# EAGLE design compute hub (EAGLE 9.3.0)
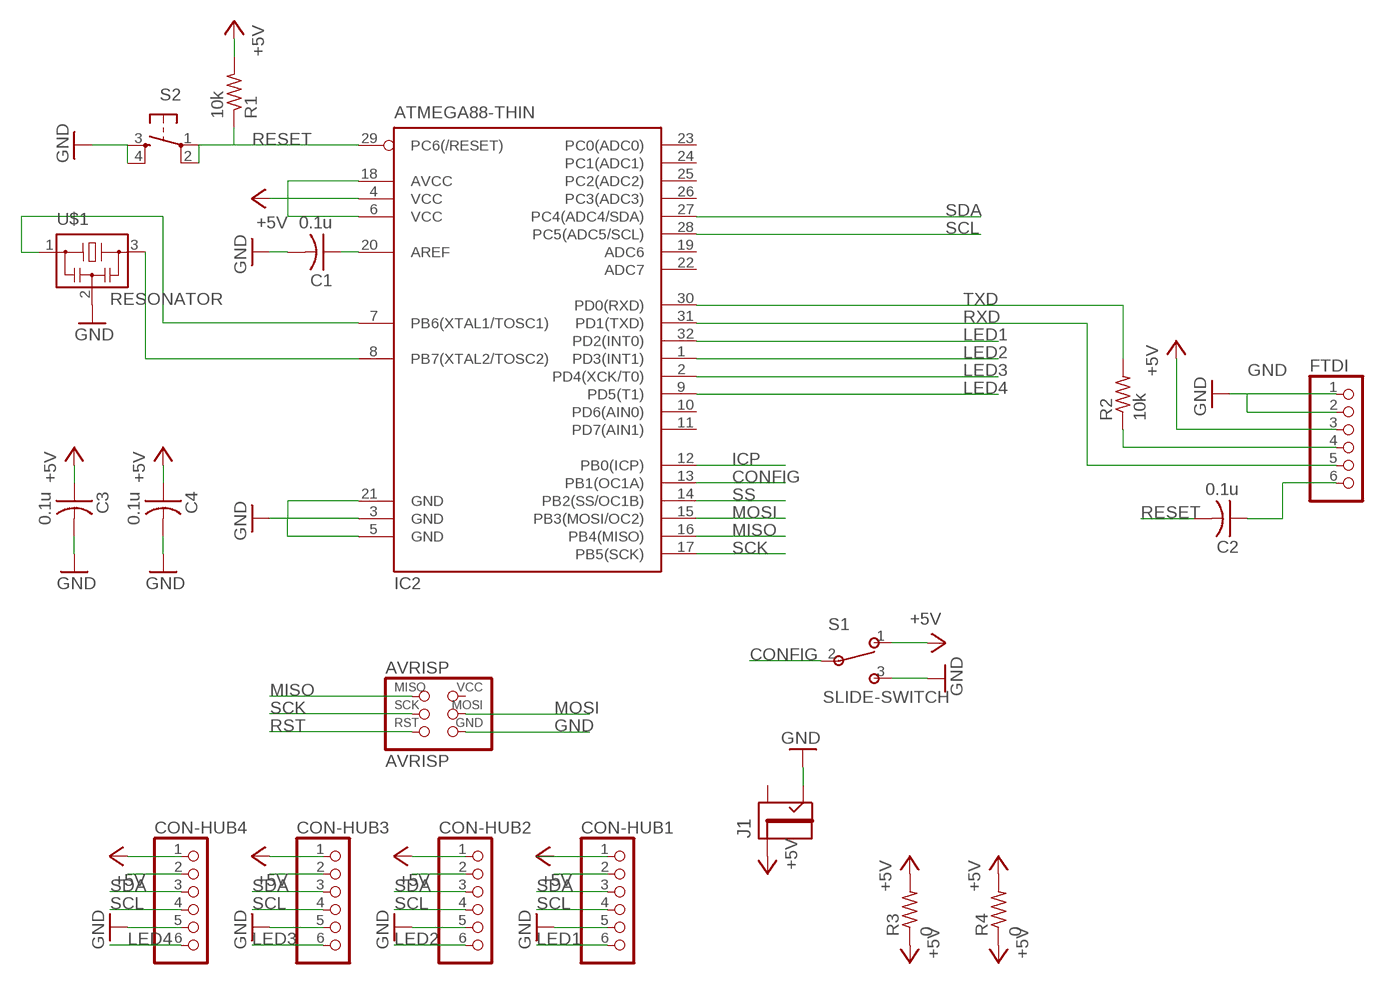
[diagram p0: schematic, sheet 1]

## Parts
AVRISP  AVRISP  [2X03]
C1  0.1u  CAP-US1206FAB  [C1206FAB]
C2  0.1u  CAP-US1206FAB  [C1206FAB]
C3  0.1u  CAP-US1206FAB  [C1206FAB]
C4  0.1u  CAP-US1206FAB  [C1206FAB]
CON-HUB1  PINHD-1X6  [1X06]
CON-HUB2  PINHD-1X6  [1X06]
CON-HUB3  PINHD-1X6  [1X06]
CON-HUB4  PINHD-1X6  [1X06]
FTDI  PINHD-1X6  [1X06]
IC2  ATMEGA88-THIN  [TQFP32-08THIN]
J1  JACK2.1MM  [JACK_2.1MM]
R1  10k  RES-US1206FAB  [R1206FAB]
R2  10k  RES-US1206FAB  [R1206FAB]
R3  0  RES-US1206FAB  [R1206FAB]
R4  0  RES-US1206FAB  [R1206FAB]
S1  SLIDE-SWITCH  [AYZ0102AGRLC]
S2  6MM_SWITCH6MM_SWITCH  [6MM_SWITCH]
U$1  RESONATOR  [EFOBM]

## Nets
+5V: C3.1 C4.1 CON-HUB1.1 CON-HUB2.1 CON-HUB3.1 CON-HUB4.1 FTDI.3 IC2.4(VCC) IC2.6(VCC) IC2.18(AVCC) J1.PIN R1.2 R3.1 R3.2 R4.1 R4.2
CONFIG: IC2.13(PB1(OC1A)) S1.2
GND: AVRISP.6(GND) C1.2 C3.2 C4.2 CON-HUB1.5 CON-HUB2.5 CON-HUB3.5 CON-HUB4.5 FTDI.1 FTDI.2 IC2.3(GND) IC2.5(GND) IC2.21(GND) J1.CONTACT S1.3 S2.3(S) S2.4(S1) U$1.2
ICP: IC2.12(PB0(ICP))
LED1: CON-HUB1.6 IC2.32(PD2(INT0))
LED2: CON-HUB2.6 IC2.1(PD3(INT1))
LED3: CON-HUB3.6 IC2.2(PD4(XCK/T0))
LED4: CON-HUB4.6 IC2.9(PD5(T1))
MISO: AVRISP.1(MISO) IC2.16(PB4(MISO))
MOSI: AVRISP.4(MOSI) IC2.15(PB3(MOSI/OC2))
N$5: C1.1 IC2.20(AREF)
N$6: IC2.8(PB7(XTAL2/TOSC2)) U$1.3
N$7: IC2.7(PB6(XTAL1/TOSC1)) U$1.1
N$8: CON-HUB1.2
N$9: CON-HUB2.2
N$10: CON-HUB3.2
N$11: FTDI.4 R2.1
N$12: CON-HUB4.2
N$13: S1.1 ; supply symbol labelled +5V
N$27: C2.1 FTDI.6
RESET: C2.2 IC2.29(PC6(/RESET)) R1.1 S2.1(P) S2.2(P1)
RST: AVRISP.5(RST)
RXD: FTDI.5 IC2.31(PD1(TXD))
SCK: AVRISP.3(SCK) IC2.17(PB5(SCK))
SCL: CON-HUB1.4 CON-HUB2.4 CON-HUB3.4 CON-HUB4.4 IC2.28(PC5(ADC5/SCL))
SDA: CON-HUB1.3 CON-HUB2.3 CON-HUB3.3 CON-HUB4.3 IC2.27(PC4(ADC4/SDA))
SS: IC2.14(PB2(SS/OC1B))
TXD: IC2.30(PD0(RXD)) R2.2
Unconnected: AVRISP.2(VCC) IC2.10(PD6(AIN0)) IC2.11(PD7(AIN1)) IC2.19(ADC6) IC2.22(ADC7) IC2.23(PC0(ADC0)) IC2.24(PC1(ADC1)) IC2.25(PC2(ADC2)) IC2.26(PC3(ADC3)) J1.SHUNT

## Library data of the parts
AVRISP = fab:AVRISP
C1-C4 = fab:CAP-US
CON-HUB1-CON-HUB4 FTDI = pinhead:PINHD-1X6: PIN HEADER
IC2 = fab:ATMEGA88-THIN
J1 = fab:JACK
R1-R4 = fab:RES-US: Resistor (US Symbol) Variants with postfix FAB are widened to allow the routing of internal traces
S1 = fab:SLIDE-SWITCH: SMD slide-switch AYZ0102AGRLC as found in the fablab inventory. Includes the mounting holes. Made by Zaerc.
S2 = fab:6MM_SWITCH: OMRON SWITCH
U$1 = fab:RESONATOR

## Board
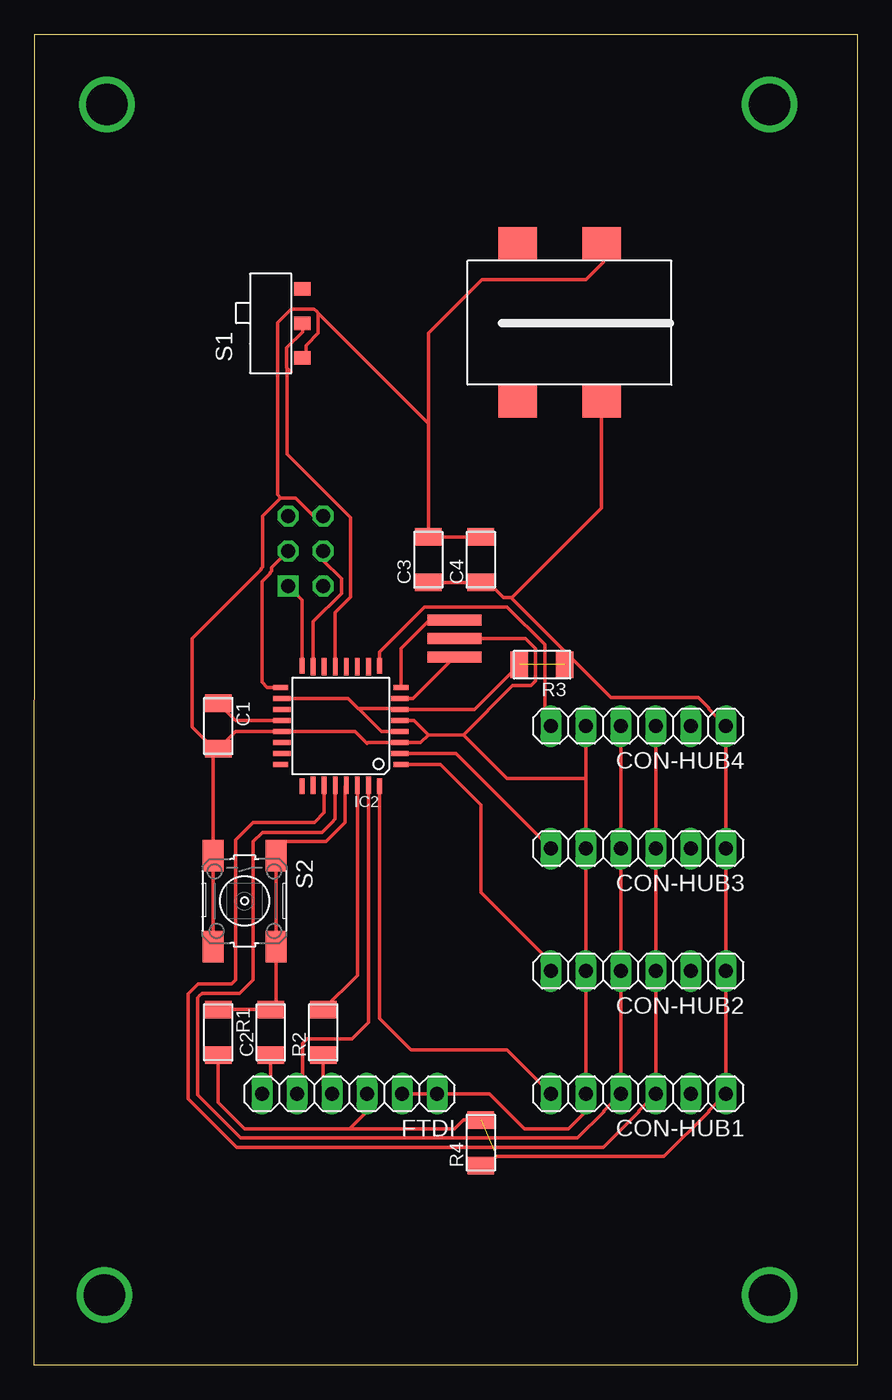
[diagram p1: board, top side]
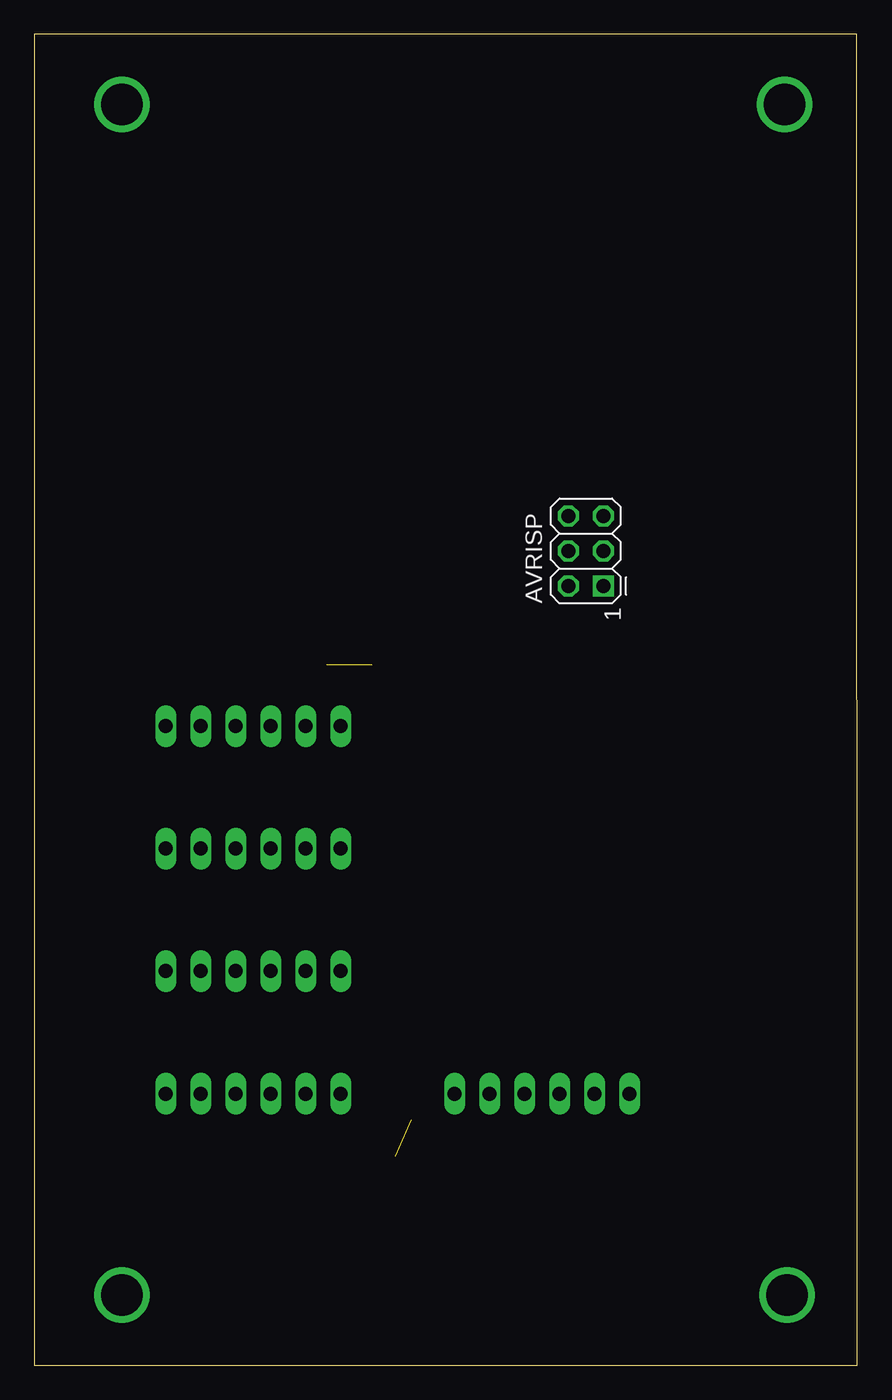
[diagram p2: board, bottom side, seen from below]

Size 59.69 x 96.52 mm. Coordinates in mm from the lower left corner, seen from the top.
Outline: 59.69,96.52 59.69,0 0,0 0.01,96.52 59.69,96.52
Copper layers (1*16): Top 0.035mm / dielectric 1.5mm / Bottom 0.035mm
Design rules "fabmodule": minimum track width 10mil, minimum drill 0.4mm, track to track 0.42mm, track to pad 0.42mm, pad to pad 0.42mm, via to via 0.42mm, smd to smd 0.42mm, copper to edge 40mil, drill to drill 0.8mm, minimum pad ring 10mil, minimum via ring 8mil, stop-mask expansion 4mil, vias tented up to drill 0mil, thermal gap 10mil

### Footprints (pad centres in the part's own frame; a part is rotated, then mirrored left to right if it is on the bottom)
2X03 = drill 1.016 square: 1 -2.54,-1.27 | drill 1.016 octagon: 2 -2.54,1.27; 3 0,-1.27; 4 0,1.27; 5 2.54,-1.27; 6 2.54,1.27
C1206FAB = smd 1.27 x 1.905: 1 -1.651,0; 2 1.651,0
1X06 = drill 1.016 long: 1 -6.35,0; 2 -3.81,0; 3 -1.27,0; 4 1.27,0; 5 3.81,0; 6 6.35,0
TQFP32-08THIN = smd 1.118 x 0.356: 1 -4.369,2.8; 8 -4.369,-2.8; 17 4.369,-2.8; 24 4.369,2.8 | smd 1.27 x 0.356: 2 -4.293,2; 3 -4.293,1.2; 4 -4.293,0.4; 5 -4.293,-0.4; 6 -4.293,-1.2; 7 -4.293,-2; 18 4.293,-2; 19 4.293,-1.2; 20 4.293,-0.4; 21 4.293,0.4; 22 4.293,1.2; 23 4.293,2 | smd 0.356 x 1.118: 9 -2.8,-4.369; 16 2.8,-4.369; 25 2.8,4.369; 32 -2.8,4.369 | smd 0.356 x 1.27: 10 -2,-4.293; 14 1.2,-4.293; 15 2,-4.293; 26 2,4.293; 27 1.2,4.293; 31 -2,4.293 | smd 0.35 x 1.27: 11 -1.2,-4.293; 12 -0.4,-4.293; 13 0.4,-4.293; 28 0.4,4.293; 29 -0.4,4.293; 30 -1.2,4.293
JACK_2.1MM = smd 2.388 x 2.794: CONTACT 5.766,-2.413; PIN -5.639,-2.413; PIN1 -5.639,3.683; SHUNT 5.766,3.683
R1206FAB = smd 1.27 x 1.905: 1 -1.651,0; 2 1.651,0
AYZ0102AGRLC = smd 1 x 1.2: 1 2.5,-2.3; 2 0,-2.3; 3 -2.5,-2.3
6MM_SWITCH = smd 2.286 x 1.524: 1 -3.302,2.286; 2 3.302,2.286; 3 -3.302,-2.286; 4 3.302,-2.286
EFOBM = smd 0.8 x 3.9: 1 -1.35,0; 2 0,0; 3 1.35,0

### Placement (x,y rotation side)
AVRISP  19.68,59.05 90 bottom
C1  13.34,46.35 270 top
C2  17.14,24.13 90 top
C3  28.57,58.42 90 top
C4  32.38,58.42 90 top
CON-HUB1  43.81,19.68 180 top
CON-HUB2  43.81,28.57 180 top
CON-HUB3  43.81,37.47 180 top
CON-HUB4  43.81,46.35 180 top
FTDI  22.86,19.68 180 top
IC2  22.23,46.35 180 top
J1  38.73,75.56 90 top
R1  13.34,24.13 270 top
R2  20.95,24.13 90 top
R3  36.83,50.8 180 top
R4  32.38,16.13 90 top
S1  17.14,75.56 90 top
S2  15.24,33.66 270 top
U$1  30.48,52.7 90 top

### Tracks (layer width: path | path; a pad name or v marks a point on that pad's centre or on a via)
+5V  (2 unrouted)
  Top 0.254: R1.2 13.34,19.05 15.24,17.14 22.86,17.14 | FTDI.3 24.13,18.41 22.86,17.14 | 33.05,56.64 32.51,56.64 C4.1 C3.1 | 33.02,56.62 33.05,56.64 | R4.1 32.77,14.61 33.02,14.61 33.54,15.12 45.68,15.12 48.93,18.38 48.93,18.45 CON-HUB1.1 CON-HUB2.1 CON-HUB3.1 CON-HUB4.1 48.93,47.59 48.93,47.66 48.17,48.43 41.82,48.43 38.48,51.77 | IC2.18 22.77,48.35 23.5,47.62 23.51,47.62 | 23.51,47.62 26.45,47.62 IC2.6 31.93,47.55 R3.2 | IC2.4 25.18,45.95 23.51,47.62 | 33.05,56.64 34.01,55.68 34.57,55.68 34.61,55.63 | 38.48,51.77 R3.1 | 34.61,55.63 38.48,51.77 | 22.86,17.14 30.48,17.14 31.11,17.78 R4.2 | J1.PIN 41.15,62.17 34.61,55.63
CONFIG
  Top 0.254: 18.33,72.31 18.3,72.34 18.3,73.79 19.45,74.94 S1.2 | 18.33,72.31 18.62,72.02 | IC2.13 21.82,54.58 22.94,55.69 22.94,61.46 18.33,66.07 18.33,72.31
GND
  Top 0.254: C4.2 C3.2 28.57,68.31 | FTDI.2 FTDI.1 33.02,19.68 35.56,17.14 38.73,17.14 40.01,18.41 CON-HUB1.5 CON-HUB2.5 CON-HUB3.5 | S2.4 S2.3 12.95,44.32 13.17,44.54 | 40.01,42.53 CON-HUB4.5 | 40.01,42.53 CON-HUB3.5 | 40.01,38.1 CON-HUB3.5 | S1.3 19.7,73.06 19.7,73.94 20.59,74.84 20.59,76.29 | 17.87,62.9 18.96,62.9 20.27,61.59 AVRISP.6 | 20.59,76.29 20.49,76.4 20.27,76.61 18.62,76.61 17.62,75.62 17.62,63.15 17.87,62.9 | 13.17,44.54 C1.2 14.59,45.95 IC2.21 23.26,45.95 24.13,45.09 24.2,45.16 IC2.3 28.01,45.16 28.57,45.72 | IC2.5 27.54,46.76 28.57,45.72 | 31.11,45.72 28.57,45.72 | 31.11,45.72 34.29,42.55 39.99,42.55 40.01,42.53 | 13.17,44.54 11.43,46.29 11.43,52.7 16.43,57.71 16.43,57.78 16.54,57.89 16.54,61.57 17.87,62.9 | U$1.2 35.63,52.7 36.36,51.98 36.36,49.62 36.04,49.3 34.7,49.3 31.11,45.72 | 28.57,68.31 20.59,76.29 | 28.57,68.31 28.57,74.85 32.46,78.74 40.01,78.74 41.27,80.01 41.27,81.2 J1.CONTACT
LED1
  Top 0.254: IC2.32 25.02,25.14 27.3,22.86 34.29,22.86 CON-HUB1.6
LED2
  Top 0.254: IC2.1 29.47,43.55 32.38,40.64 32.38,34.29 37.47,29.21 CON-HUB2.6
LED3
  Top 0.254: IC2.2 30.57,44.35 CON-HUB3.6
LED4
  Top 0.254: CON-HUB4.6 37.03,46.78 37.03,52.26 34.29,55 28.3,55 25.02,51.72 IC2.9
MISO
  Top 0.254: IC2.16 19.43,55.51 AVRISP.1
MOSI
  Top 0.254: IC2.15 20.23,53.93 22.26,55.97 22.26,57.06 20.95,58.37 AVRISP.4
N$1  (via drill 3)
  other vias: 5.27,91.44
N$2  (via drill 3)
  other vias: 5.08,5.08
N$3  (via drill 3)
  other vias: 53.34,5.08
N$4  (via drill 3)
  other vias: 53.34,91.44
N$5
  Top 0.254: IC2.20 14.59,46.76 C1.1
N$6
  Top 0.254: IC2.8 26.59,51.99 28.57,53.98 30.4,53.98 U$1.3
N$7
  Top 0.254: IC2.7 27.48,48.35 U$1.1
N$11
  Top 0.254: R2.1 20.95,20.32 FTDI.4
N$27
  Top 0.254: C2.1 17.14,20.32 FTDI.6
RESET
  Top 0.254: R1.1 C2.2 17.53,26.16 S2.2 S2.1 17.78,37.21 17.78,37.97 21.15,37.97 22.55,39.37 22.55,41.98 IC2.29
RXD
  Top 0.254: FTDI.5 19.46,20.09 19.46,23.34 19.78,23.66 23.03,23.66 24.23,24.86 IC2.31
SCK
  Top 0.254: IC2.17 16.89,49.16 16.51,49.53 16.51,56.83 17.11,57.43 17.11,57.5 17.21,57.61 17.21,57.85 AVRISP.3
SCL
  Top 0.254: CON-HUB4.4 CON-HUB3.4 CON-HUB2.4 CON-HUB1.4 41.31,18.45 41.31,18.38 39.4,16.47 14.96,16.47 11.84,19.6 11.84,26.64 11.96,26.77 12.16,26.96 14.9,26.96 15.88,27.94 15.88,37.98 16.54,38.65 20.87,38.65 21.47,39.25 21.59,39.37 21.82,39.6 IC2.28
SDA
  Top 0.254: CON-HUB4.3 CON-HUB3.3 CON-HUB2.3 CON-HUB1.3 43.85,18.45 43.85,18.38 41.27,15.8 14.68,15.8 11.16,19.32 11.16,26.92 11.88,27.64 14.3,27.64 14.61,27.94 14.61,38.1 15.88,39.37 20.32,39.37 21.02,40.08 IC2.27
TXD
  Top 0.254: IC2.30 23.43,28.25 R2.2